# Altium schematic sheet RPE_Sch_Updated(NOT FINISHED)Feb12.SchDoc
size A4; SheetNumber: 2; SheetTotal: 2
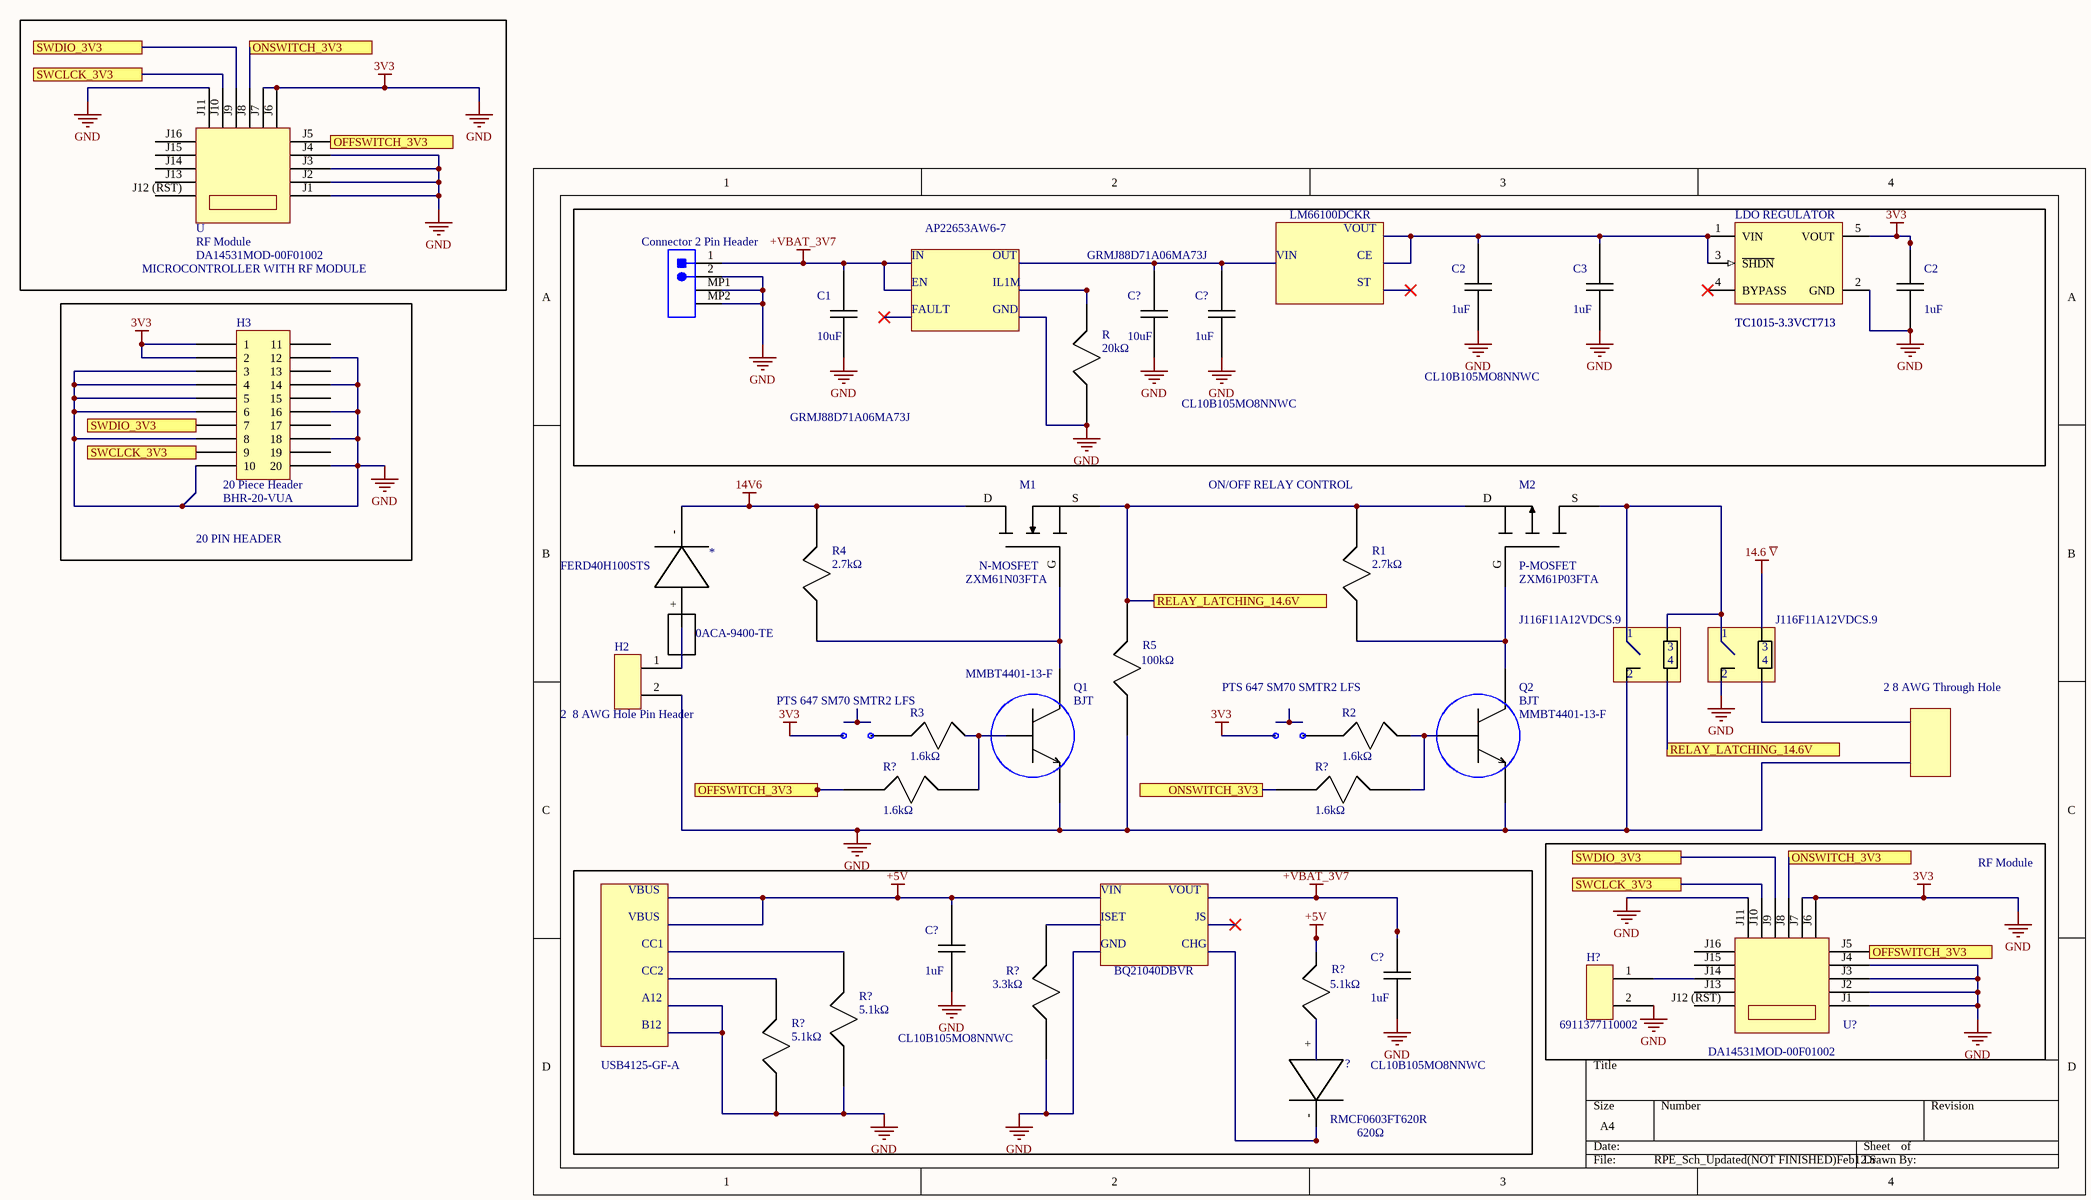
[diagram p0: RPE_Sch_Updated(NOT FINISHED)Feb12.SchDoc]

## Parts
(Parts that share a designator on the sheet are numbered #1, #2 ... from top to bottom, then left to right.)
*  FERD40H100STS
?#1  Connector 2 Pin Header
?#2  RMCF0603FT620R
C1  value 10uF  (hidden comment: 1 uF Capacitor)
C2#1  value 1uF  (hidden comment: 1 uF Capacitor)
C2#2  value 1uF  (hidden comment: 1 uF Capacitor)
C3  value 1uF  (hidden comment: 1 uF Capacitor)
C?#1  value 10uF  (hidden comment: 1 uF Capacitor)
C?#2  value 1uF  (hidden comment: 1 uF Capacitor)
C?#3  value 1uF  (hidden comment: 1 uF Capacitor)
C?#4  value 1uF  (hidden comment: 1 uF Capacitor)
H2  2  8 AWG Hole Pin Header
H3  20 Piece Header
H?  6911377110002
LDO_REGULATOR  TC1015-3.3VCT713
M1  N-MOSFET
M2  P-MOSFET
Q1  BJT  Manufacturer Part Number: MMBT4401-13-F
Q2  BJT  Manufacturer Part Number: MMBT4401-13-F
R  20kΩ
R1  2.7kΩ
R2  1.6kΩ
R3  1.6kΩ
R4  2.7kΩ
R5  Resistance: 100kΩ  (hidden comment: 100 k Resistor)
R?#1  1.6kΩ
R?#2  1.6kΩ
R?#3  3.3kΩ
R?#4  5.1kΩ
R?#5  5.1kΩ
R?#6  5.1kΩ
U  RF Module
U?  RF Module

## Blocks framed on the sheet
MICROCONTROLLER WITH RF MODULE: U
20 PIN HEADER: H3

## Ports
OFFSWITCH_3V3 (see RPE_Sch_Finished[0@], RPE_Sch_Finished[1C]), OFFSWITCH_3V3 (see RPE_Sch_Finished[0@], RPE_Sch_Finished[4D]), OFFSWITCH_3V3 (see RPE_Sch_Finished[1C], RPE_Sch_Finished[4D]), ONSWITCH_3V3 (see RPE_Sch_Finished[0@], RPE_Sch_Finished[2C]), ONSWITCH_3V3 (see RPE_Sch_Finished[0@], RPE_Sch_Finished[4C]), ONSWITCH_3V3 (see RPE_Sch_Finished[2C], RPE_Sch_Finished[4C]), RELAY_LATCHING_14.6V (see RPE_Sch_Finished[2B]), RELAY_LATCHING_14.6V (see RPE_Sch_Finished[4B]), SWCLCK_3V3 (see RPE_Sch_Finished[0@], RPE_Sch_Finished[0B]), SWCLCK_3V3 (see RPE_Sch_Finished[0@], RPE_Sch_Finished[3C]), SWCLCK_3V3 (see RPE_Sch_Finished[0B], RPE_Sch_Finished[3C]), SWDIO_3V3 (see RPE_Sch_Finished[0@], RPE_Sch_Finished[0B]), SWDIO_3V3 (see RPE_Sch_Finished[0@], RPE_Sch_Finished[3C]), SWDIO_3V3 (see RPE_Sch_Finished[0B], RPE_Sch_Finished[3C])

## Nets
3V3: ?#1.2 ?#1.MP1 ?#1.MP2 C1.?2 C2#1.?2 C2#2.?1 C2#2.?2 C3.?2 C?#1.?2 C?#2.?2 C?#3.?2 C?#4.?2 H2.2 H3.?2(12) H3.?4(14) H3.?6(16) H3.?8(18) H3.?10(20) H3.?11(1) H3.?12(2) H3.?13(3) H3.?14(4) H3.?15(5) H3.?16(6) H3.?18(8) H3.?20(10) H?.2 LDO_REGULATOR.2(GND) LDO_REGULATOR.5(VOUT) Q1.?2 Q2.?2 R.?2 R5.?2 R?#3.?2 R?#5.?2 R?#6.?2 U.J1 U.J2 U.J3 U.J4 U.J6 U.J7 U.J11 U?.J1 U?.J2 U?.J3 U?.J4 U?.J6 U?.J7 U?.J11  [also labelled GND]
14V6: *.- M1.D R4.?1
+5V: C?#3.?1 R?#4.?1
+VBAT_3V7: ?#1.1 C1.?1 C?#4.?1
OFFSWITCH_3V3: R?#1.?2 U.J5 U?.J5 ; port OFFSWITCH_3V3
ONSWITCH_3V3: R?#2.?2 U.J8 U?.J8 ; port ONSWITCH_3V3
RELAY_LATCHING_14.6V: M1.S M2.D R1.?1 R5.?1 ; port RELAY_LATCHING_14.6V
SWCLCK_3V3: H3.?19(9) U.J10 U?.J10 ; port SWCLCK_3V3
SWDIO_3V3: H3.?17(7) U.J9 U?.J9 ; port SWDIO_3V3
Net*_+: *.+ H2.1
Net?#2_+: ?#2.+ R?#4.?2
NetC2#1_?1: C2#1.?1 C3.?1 LDO_REGULATOR.1(VIN) LDO_REGULATOR.3(~{SHDN})
NetC?#1_?1: C?#1.?1 C?#2.?1
NetH?_1: H?.1 U?.J14
NetM1_G: M1.G Q1.?1 R4.?2
NetM2_G: M2.G Q2.?1 R1.?2
NetQ1_?3: Q1.?3 R3.?1 R?#1.?1
NetQ2_?3: Q2.?3 R2.?1 R?#2.?1

Not connected (* = marked no-connect by the designer): ?#2 -; H3 ?1(11) ?3(13) ?5(15) ?7(17) ?9(19); LDO_REGULATOR 4(BYPASS)*; M2 S; R ?1; R2 ?2; R3 ?2; R?#3 ?1; R?#5 ?1; R?#6 ?1; U J12 (RST) J13 J14 J15 J16; U? J12 (RST) J13 J15 J16

## Notes on the sheet
- IN
- AP22653AW6-7
- OUT
- (near C?#1) GRMJ88D71A06MA73J
- VIN
- LM66100DCKR
- VOUT
- CE
- FAULT
- EN
- GND
- IL1M
- ST
- CL10B105MO8NNWC
- GRMJ88D71A06MA73J
- ON/OFF RELAY CONTROL
- 0ACA-9400-TE
- J116F11A12VDCS.9
- 1
- 2
- 3
- 4
- (near R3) PTS 647 SM70 SMTR2 LFS
- (near R2) PTS 647 SM70 SMTR2 LFS
- 2 8 AWG Through Hole
- VBUS
- CC1
- ISET
- CHG
- JS
- CC2
- A12
- BQ21040DBVR
- USB4125-GF-A
- B12
- (near ?#2) 620Ω

## Library data of the parts
* ?#2 = FERD40H100STS-Symbol-1
?#1 = CN-1P-2M-R2
C1 C2#1 C2#2 C3 C?#1-C?#4 = CL10B105MO8NNWC: SMD Multilayer Ceramic Capacitor, 1 µF, 16 V, 0603 [1608 Metric], ± 20%, X7R, CL Series; Manufacturer: Samsung; Material: 4241ConductorMaterial; Voltage Rating: 16V; Dielectric: 1511DielectricType; Supplier: Digi-Key; Supplier Part Number: 1276-6524-1-ND; Manufacturer Part Number: CL10B105MO8NNWC; RoHS: Yes; Category: Ceramic Capacitors; Stock: 1597349; Pricing: 1=0.1, 10=0.034, 50=0.0196, 100=0.0152, 500=0.01142, 1000=0.00897 (USD); Mounting Technology: Surface Mount; Case/Package: 0603; Case Code (Metric): 1608; Case Code (Imperial): 0603; Min Operating Temperature: -55°C; Max Operating Temperature: 125°C; Packaging: Cut Tape; Tolerance: 20%; Series: CL; Voltage Rating (DC): 16V; Length: 0.063inch; Width: 0.031inch; Height: 900um; Thickness: 0.035inch; RoHS Compliant: Yes; ComponentLink1URL: https://media.digikey.com/pdf/Data%20Sheets/Samsung%20PDFs/CL10B105MO8NNWC.pdf?src-supplier=Digi-Key; ComponentLink1Description: https://media.digikey.com/pdf/Data%20Sheets/Samsung%20PDFs/CL10B105MO8NNWC.pdf?src-supplier=Digi-Key; ComponentLink2URL: http://www.farnell.com/datasheets/2710574.pdf?src-supplier=Farnell; ComponentLink2Description: http://www.farnell.com/datasheets/2710574.pdf?src-supplier=Farnell; ComponentLink3URL: https://datasheet.octopart.com/CL10B105MO8NNWC-Samsung-Electro-Mechanics-datasheet-120079234.pdf?src-supplier=Future+Electronics; ComponentLink3Description: https://datasheet.octopart.com/CL10B105MO8NNWC-Samsung-Electro-Mechanics-datasheet-120079234.pdf?src-supplier=Future+Electronics; ComponentLink4URL: http://www.farnell.com/datasheets/2710574.pdf?src-supplier=Newark; ComponentLink4Description: http://www.farnell.com/datasheets/2710574.pdf?src-supplier=Newark; ComponentLink5URL: http://www.farnell.com/datasheets/2710574.pdf?src-supplier=Element14; ComponentLink5Description: http://www.farnell.com/datasheets/2710574.pdf?src-supplier=Element14
H2 H? = 2 Pin Header
H3 = BHR-20-VUA: Conn Shrouded Header (4 Sides) HDR 20 POS 2.54mm Solder ST Top Entry Thru-Hole Tray; Manufacturer: Adam Equipment; Number of Positions: 20; Voltage Rating (AC): 250V; Current Rating: 1A; Supplier: Digi-Key; Supplier Part Number: 2057-BHR-20-VUA-ND; RoHS: Yes; Category: Card Edge Connectors; Stock: 4101; Pricing: 1=0.4, 10=0.339, 160=0.26356, 480=0.2259, 960=0.18824, 4960=0.16135, 10080=0.15059 (USD); Contact Material: Brass; Contact Shape: Square; Contact Finish - Mating: GOLD; Insulation Material: PBT; Contact Plating: Gold; Min Operating Temperature: -50°C; Max Operating Temperature: 105°C; Number of Rows: 2; Packaging: Tray; Termination: Solder; Series: BHR; Connector Type: Header; Fastening Type: Pull; Contact Type: Male Pin; Package Quantity: 216; Pitch: 2.54mm; Flammability Rating: UL94 V-0; Lead Free: Lead Free; ComponentLink1URL: https://datasheet.ciiva.com/16418/page-319-321-16418950.pdf?src-supplier=Future+Electronics; ComponentLink1Description: https://datasheet.ciiva.com/16418/page-319-321-16418950.pdf?src-supplier=Future+Electronics; Manufacturer Part Number: BHR-20-VUA
LDO_REGULATOR = TC1015-3.3VCT713: TC1015 Series 100 mA 3.3 V Fixed Output LDO Regulator w/ Shutdown - SOT-23-5; Manufacturer: Microchip; Min Input Voltage: 2.7V; Max Supply Voltage: 6V; Output Voltage: 3.3V; Number of Outputs: 1; Polarity: Positive; Accuracy: 2.5%; Max Output current: 100mA; Dropout Voltage: 180mV; Quiescent Current: 80uA; Power Supply Rejection Ratio (PSRR): 64dB; Number of Channels: 1NUMBER; Supplier: Digi-Key; Supplier Part Number: TC1015-3.3VCT713CT-ND; RoHS: Yes; Category: Voltage Regulators - Linear; Stock: 18340; Pricing: 1=0.49, 25=0.41, 100=0.36 (USD); Mounting Technology: Surface Mount; Case/Package: SOT-23; Pins: 5; Min Operating Temperature: -40°C; Max Operating Temperature: 125°C; Packaging: Tape and Reel; Output Type: Fixed; Series: -; Package Quantity: 3000; Output Current: 100mA; Number of Regulators: 1; Termination: SMD/SMT; Current Rating: 100mA; Min Supply Voltage: 2.7V; Nominal Output Voltage: 3.3V; Min Output Voltage: 3.3V; Max Output Voltage: 3.3V; Output Configuration: Positive; Length: 3.1mm; Width: 1.8mm; Height: 1.3mm; Radiation Hardening: No; RoHS Compliant: Yes; Reach SVHC Compliant: No; Lead Free: Lead Free; ComponentLink1URL: https://datasheet.ciiva.com/41463/001085540-da-01-en-ic-reg-ldo-tc1015-3-3vct713-sot-23-5-mcp-41463228.pdf?src-supplier=Conrad; ComponentLink1Description: https://datasheet.ciiva.com/41463/001085540-da-01-en-ic-reg-ldo-tc1015-3-3vct713-sot-23-5-mcp-41463228.pdf?src-supplier=Conrad; ComponentLink2URL: https://datasheet.ciiva.com/8238/jp011417-8238485.pdf?src-supplier=Avnet; ComponentLink2Description: https://datasheet.ciiva.com/8238/jp011417-8238485.pdf?src-supplier=Avnet; ComponentLink3URL: https://datasheet.ciiva.com/2040/filehandler-aspxddocname-en026002-2040022.pdf?src-supplier=Digi-Key; ComponentLink3Description: https://datasheet.ciiva.com/2040/filehandler-aspxddocname-en026002-2040022.pdf?src-supplier=Digi-Key; ComponentLink4URL: https://datasheet.ciiva.com/2040/filehandler-aspxddocname-en026002-2040023.pdf?src-supplier=Digi-Key; ComponentLink4Description: https://datasheet.ciiva.com/2040/filehandler-aspxddocname-en026002-2040023.pdf?src-supplier=Digi-Key; ComponentLink5URL: https://datasheet.ciiva.com/2040/filehandler-aspxddocname-en026002-2040024.pdf?src-supplier=Digi-Key; ComponentLink5Description: https://datasheet.ciiva.com/2040/filehandler-aspxddocname-en026002-2040024.pdf?src-supplier=Digi-Key; ComponentLink6URL: https://datasheet.ciiva.com/2075/21335e-2075754.pdf?src-supplier=Digi-Key; ComponentLink6Description: https://datasheet.ciiva.com/2075/21335e-2075754.pdf?src-supplier=Digi-Key; ComponentLink7URL: https://datasheet.ciiva.com/14562/70046349-14562758.pdf?src-supplier=Allied+Electronics; ComponentLink7Description: https://datasheet.ciiva.com/14562/70046349-14562758.pdf?src-supplier=Allied+Electronics; ComponentLink8URL: https://datasheet.ciiva.com/22711/82112-22711035.pdf?src-supplier=Element14; ComponentLink8Description: https://datasheet.ciiva.com/22711/82112-22711035.pdf?src-supplier=Element14; ComponentLink9URL: https://datasheet.ciiva.com/8041/21335e-8041544.pdf?src-supplier=Element14; ComponentLink9Description: https://datasheet.ciiva.com/8041/21335e-8041544.pdf?src-supplier=Element14; Manufacturer Part Number: TC1015-3.3VCT713
M1 = ZXM61N03FTA: N-Channel 30V 1.4A (Ta) 625mW (Ta) Surface Mount SOT-23-3; Manufacturer: Diodes Zetex; Rise Time: 2.5ns; Gate to Source Voltage (Vgs): 20V; Turn-Off Delay Time: 5.8ns; Turn-On Delay Time: 1.9ns; Rds On Max: 220mR; Input Capacitance: 150pF; Nominal Vgs: 1V; Number of Elements: 1; Power Dissipation: 806mW; Current Rating: 1.2A; Supplier: Digi-Key; Supplier Part Number: ZXM61N03FCT-ND; RoHS: Yes; Category: MOSFETs; Stock: 141855; Pricing: 1=0.46, 10=0.397, 100=0.2757, 500=0.21528, 1000=0.17498 (USD); Mounting Technology: Surface Mount; Case/Package: SOT-23; Pins: 3; Weight: 0.000282oz; Min Operating Temperature: -55°C; Max Operating Temperature: 150°C; Fall Time: 2.5ns; Package Quantity: 3000; Packaging: Tape and Reel; Max Power Dissipation: 625mW; Dual Supply Voltage: 30V; Drain to Source Voltage (Vdss): 30V; Continuous Drain Current (ID): 1.4A; Number of Channels: 1; Drain to Source Resistance: 220mR; Termination: SMD/SMT; Voltage Rating (DC): 30V; Polarity: N-CHANNEL; Series: -; Drain-source On Resistance-Max: 220mR; Length: 3.04mm; Width: 1.4mm; Height: 1.02mm; Radiation Hardening: No; Reach SVHC Compliant: No; Lead Free: Lead Free; RoHS Compliant: Yes; ComponentLink1URL: https://datasheet.ciiva.com/11176/zxm61n03f-11176547.pdf?src-supplier=Avnet; ComponentLink1Description: https://datasheet.ciiva.com/11176/zxm61n03f-11176547.pdf?src-supplier=Avnet; ComponentLink2URL: https://datasheet.ciiva.com/935/zxm61n03f-935122.pdf?src-supplier=Digi-Key; ComponentLink2Description: https://datasheet.ciiva.com/935/zxm61n03f-935122.pdf?src-supplier=Digi-Key; ComponentLink3URL: https://datasheet.ciiva.com/5775/1643170-5775147.pdf?src-supplier=Farnell; ComponentLink3Description: https://datasheet.ciiva.com/5775/1643170-5775147.pdf?src-supplier=Farnell; ComponentLink4URL: https://datasheet.ciiva.com/935/zxm61n03f-935123.pdf?src-supplier=Digi-Key; ComponentLink4Description: https://datasheet.ciiva.com/935/zxm61n03f-935123.pdf?src-supplier=Digi-Key; ComponentLink5URL: https://datasheet.ciiva.com/935/zxm61n03f-935124.pdf?src-supplier=Digi-Key; ComponentLink5Description: https://datasheet.ciiva.com/935/zxm61n03f-935124.pdf?src-supplier=Digi-Key; ComponentLink6URL: https://datasheet.ciiva.com/8024/1643170-8024088.pdf?src-supplier=Element14; ComponentLink6Description: https://datasheet.ciiva.com/8024/1643170-8024088.pdf?src-supplier=Element14; Manufacturer Part Number: ZXM61N03FTA
M2 = ZXM61P03FTA: ZXM61P03F 30 V 0.35 Ohm P-Channel Enhancement Mode Vertical DMOS FET - SOT-23; Manufacturer: Diodes Zetex; Rise Time: 2.9ns; Gate to Source Voltage (Vgs): 20V; Turn-Off Delay Time: 8.9ns; Turn-On Delay Time: 1.9ns; Nominal Vgs: -1V; Max Power Dissipation: 625mW; Rds On Max: 350mR; Input Capacitance: 140pF; Number of Elements: 1; Dual Supply Voltage: -30V; Drain to Source Voltage (Vdss): 30V; Continuous Drain Current (ID): 1.1A; Drain to Source Resistance: 550mR; Power Dissipation: 806mW; Current Rating: -1.1A; Supplier: Digi-Key; Supplier Part Number: ZXM61P03FCT-ND; RoHS: Yes; Category: MOSFETs; Stock: 114739; Pricing: 1=0.42, 10=0.357, 100=0.2482, 500=0.19376, 1000=0.15748 (USD); Mounting Technology: Surface Mount; Case/Package: SOT-23; Pins: 3; Weight: 0.000282oz; Min Operating Temperature: -55°C; Max Operating Temperature: 150°C; Fall Time: 2.9ns; Packaging: Tape and Reel; Package Quantity: 3000; Number of Channels: 1; Termination: SMD/SMT; Voltage Rating (DC): -30V; Polarity: P-CHANNEL; Series: -; Drain-source On Resistance-Max: 350mR; Length: 3.04mm; Width: 1.4mm; Height: 1.02mm; Radiation Hardening: No; Reach SVHC Compliant: No; Lead Free: Lead Free; RoHS Compliant: Yes; ComponentLink1URL: https://datasheet.ciiva.com/11176/zxm61p03f-11176401.pdf?src-supplier=Avnet; ComponentLink1Description: https://datasheet.ciiva.com/11176/zxm61p03f-11176401.pdf?src-supplier=Avnet; ComponentLink2URL: https://datasheet.ciiva.com/11176/zxm61p03f-11176557.pdf?src-supplier=Avnet; ComponentLink2Description: https://datasheet.ciiva.com/11176/zxm61p03f-11176557.pdf?src-supplier=Avnet; ComponentLink3URL: https://datasheet.ciiva.com/935/zxm61p03f-935140.pdf?src-supplier=Digi-Key; ComponentLink3Description: https://datasheet.ciiva.com/935/zxm61p03f-935140.pdf?src-supplier=Digi-Key; ComponentLink4URL: https://datasheet.ciiva.com/935/zxm61p03f-935141.pdf?src-supplier=Digi-Key; ComponentLink4Description: https://datasheet.ciiva.com/935/zxm61p03f-935141.pdf?src-supplier=Digi-Key; ComponentLink5URL: https://datasheet.ciiva.com/935/zxm61p03f-935142.pdf?src-supplier=Digi-Key; ComponentLink5Description: https://datasheet.ciiva.com/935/zxm61p03f-935142.pdf?src-supplier=Digi-Key; ComponentLink6URL: https://datasheet.ciiva.com/4443/zxm61p03f-4443147.pdf?src-supplier=Mouser; ComponentLink6Description: https://datasheet.ciiva.com/4443/zxm61p03f-4443147.pdf?src-supplier=Mouser; ComponentLink7URL: https://datasheet.ciiva.com/16216/zxm61p03f-16216056.pdf?src-supplier=Future+Electronics; ComponentLink7Description: https://datasheet.ciiva.com/16216/zxm61p03f-16216056.pdf?src-supplier=Future+Electronics; Manufacturer Part Number: ZXM61P03FTA
Q1 Q2 = MMBT4401-13-F (2): Bipolar Transistors - 40V NPN SMALL SIGNAL TRANSISTOR IN SOT23 package; Manufacturer: Diodes Zetex; Max Power Dissipation: 310mW; Frequency: 250MHz; Max Collector Current: 600mA; Collector Base Voltage (VCBO): 60V; Number of Elements: 1; Emitter Base Voltage (VEBO): 6V; Collector-emitter Voltage-Max: 750mV; RoHS: Yes; Category: BJTs; Stock: 197669; Pricing: 1=0.14, 10=0.082, 50=0.082, 100=0.042, 1000=0.023, 10000=0.014 (USD); Mounting Technology: Surface Mount; Case/Package: SOT-23; Pins: 3; Min Operating Temperature: -55°C; Max Operating Temperature: 150°C; Packaging: Tape and Reel; Collector Emitter Voltage (VCEO): 40V; Transition Frequency: 250MHz; Polarity: NPN; Power Dissipation: 310mW; Collector Emitter Breakdown Voltage: 40V; Series: Automotive, AEC-Q101; Clock Frequency: 250MHz; Radiation Hardening: No; Reach SVHC Compliant: No; RoHS Compliant: Yes; ComponentLink1URL: https://datasheet.ciiva.com/15139/getdatasheetpartid-234007-15139792.pdf?src-supplier=Verical; ComponentLink1Description: https://datasheet.ciiva.com/15139/getdatasheetpartid-234007-15139792.pdf?src-supplier=Verical; Supplier: Mouser; Supplier Part Number: 1-MMBT4401-13-F
R R2 R3 R?#1-R?#6 = SG73P1JTTD1601F: Res, 1K6, 1%, 0.2W, 0603 Rohs Compliant: Yes; Manufacturer: KOA Speer; Power Rating: 200mW; Voltage Rating: 50V; Temperature Coefficient: 100ppm/°C; Value: 1.6kR; Supplier: Digi-Key; Supplier Part Number: 2019-SG73P1JTTD1601FTR-ND; Manufacturer Part Number: SG73P1JTTD1601F; RoHS: Yes; Category: Chip SMD Resistors; Stock: 5000; Pricing: 5000=0.01791 (USD); Case/Package: 0603; Pins: 2; Case Code (Imperial): 0603; Case Code (Metric): 1608; Min Operating Temperature: -55°C; Max Operating Temperature: 155°C; Packaging: Tape and Reel; Package Quantity: 5000; Tolerance: 1%; Voltage Rating (DC): 50V; Resistor Type: Thick Film; Termination: SMD/SMT; Series: SG73; Resistance Tolerance: 1%; Length: 1.6mm; Width: 0.8mm; Height: 0.45mm; RoHS Compliant: Yes; Reach SVHC Compliant: Unknown; ComponentLink1URL: https://datasheet.ciiva.com/22640/78338-22640856.pdf?src-supplier=Farnell; ComponentLink1Description: https://datasheet.ciiva.com/22640/78338-22640856.pdf?src-supplier=Farnell
R1 R4 = CR0603-FX-2701ELF: SMD Chip Resistor, 2.7 kOhm, ± 1%, 100 mW, 0603 [1608 Metric], Thick Film, General Purpose; Manufacturer: Bourns; Power Rating: 100mW; Voltage Rating: 50V; Temperature Coefficient: 100ppm/°C; Value: 2.7kR; Supplier: Digi-Key; Supplier Part Number: CR0603-FX-2701ELFDKR-ND; Manufacturer Part Number: CR0603-FX-2701ELF; RoHS: Yes; Category: Chip SMD Resistors; Stock: 119692; Pricing: 1=0.1, 10=0.015, 50=0.009, 100=0.0075, 500=0.00498, 1000=0.00425 (USD); Mounting Technology: Surface Mount; Case/Package: 0603; Case Code (Imperial): 0603; Case Code (Metric): 1608; Contact Plating: Tin; Min Operating Temperature: -55°C; Max Operating Temperature: 155°C; Tolerance: 1%; Packaging: Tape and Reel; Package Quantity: 5000; Termination: SMD/SMT; Number of Terminations: 2; Max Power Dissipation: 100mW; Features: Moisture Resistant; Series: CR0603; Voltage Rating (DC): 50V; Length: 0.063inch; Width: 0.031inch; Height: 0.022inch; Thickness: 457um; Radiation Hardening: No; RoHS Compliant: Yes; ComponentLink1URL: https://datasheet.ciiva.com/18607/chpreztr-18607957.pdf?src-supplier=Digi-Key; ComponentLink1Description: https://datasheet.ciiva.com/18607/chpreztr-18607957.pdf?src-supplier=Digi-Key
R5 = CR0603FB100KS1 Chip Resistor: CR0603FB100KS1 Chip Resistor, 100kΩ
U U? = DA14531MOD-00F01002: Bluetooth Low Energy 5.1 Module Rohs Compliant: Yes; Manufacturer: Dialog Semiconductor; Supplier: Digi-Key; Supplier Part Number: 1695-DA14531MOD-00F01002CT-ND; RoHS: Yes; Category: RF Receivers, Transceivers; Stock: 232067; Pricing: 1=5.66, 10=5.05, 25=4.5448, 100=4.141, 250=3.737, 500=3.3532 (USD); ComponentLink1URL: https://www.dialog-semiconductor.com/da14531-module-datasheet?src-supplier=Digi-Key; ComponentLink1Description: https://www.dialog-semiconductor.com/da14531-module-datasheet?src-supplier=Digi-Key; Manufacturer Part Number: DA14531MOD-00F01002